# EAGLE design PIC32 USB DAQ Board v1.2 (EAGLE 5.06)
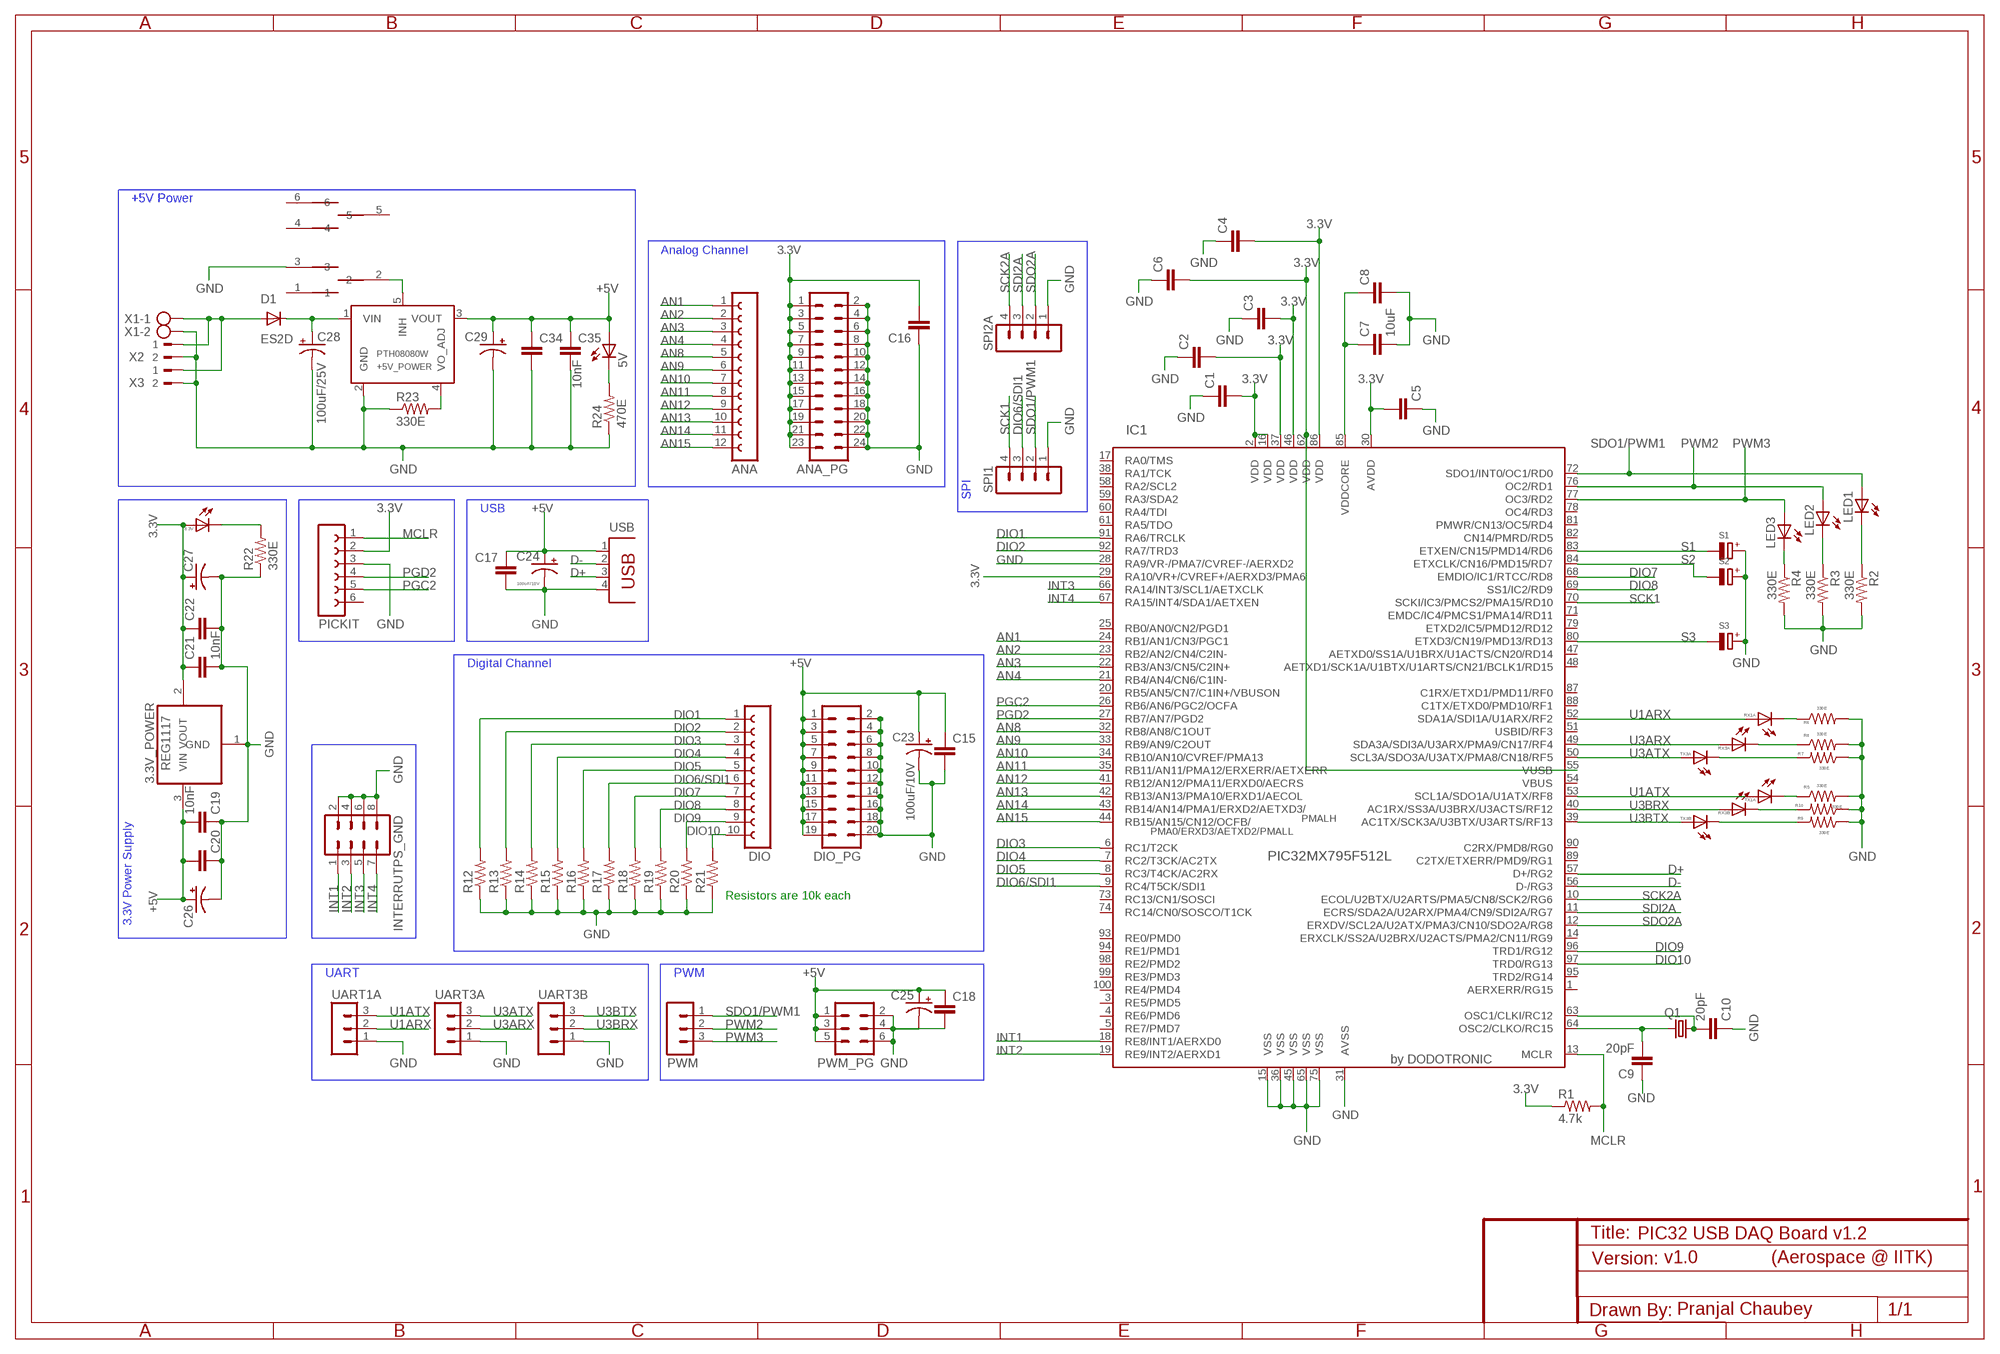
[diagram p0: schematic, sheet 1]

## Parts
3.3V  LEDCHIPLED_0805  [CHIPLED_0805]
3.3V_POWER  REG1117  [SOT223]
5V  LEDCHIPLED_0805  [CHIPLED_0805]
+5V_POWER  PTH08080W  [PTH08080W]
ANA  FE12-1  [FE12]
ANA_PG  MA12-2  [MA12-2]
C1  C-EUC0805  [C0805]
C2  C-EUC0805  [C0805]
C3  C-EUC0805  [C0805]
C4  C-EUC0805  [C0805]
C5  C-EUC0805  [C0805]
C6  C-EUC0805  [C0805]
C7  10uF  C-EUC0805  [C0805]
C8  C-EUC0805  [C0805]
C9  20pF  C-EUC0805  [C0805]
C10  20pF  C-EUC0805  [C0805]
C15  C-EUC0805  [C0805]
C16  C-EUC0805  [C0805]
C17  C-EUC0805  [C0805]
C18  C-EUC0805  [C0805]
C19  10nF  C-EUC0805  [C0805]
C20  C-EUC0805  [C0805]
C21  10nF  C-EUC0805  [C0805]
C22  C-EUC0805  [C0805]
C23  100uF/10V  CPOL-USE2.5-6  [E2,5-6@1]
C24  100uF/10V  CPOL-USE2.5-6  [E2,5-6@1]
C25  CPOL-USE2.5-6  [E2,5-6@1]
C26  CPOL-USE2.5-6  [E2,5-6@1]
C27  CPOL-USE2.5-6  [E2,5-6@1]
C28  100uF/25V  CPOL-USE2.5-6  [E2,5-6@1]
C29  CPOL-USE2.5-6  [E2,5-6@1]
C34  C-EUC0805  [C0805]
C35  10nF  C-EUC0805  [C0805]
D1  ES2D  [SMB]
DIO  FE10-1  [FE10]
DIO_PG  MA10-2  [MA10-2]
IC1  PIC32MX795F512L  [TQFP100_14X14]
INTERRUTPS_GND  MA04-2  [MA04-2]
LED1  LEDCHIPLED_0805  [CHIPLED_0805]
LED2  LEDCHIPLED_0805  [CHIPLED_0805]
LED3  LEDCHIPLED_0805  [CHIPLED_0805]
PICKIT  FE06-1  [FE06]
PWM  MA03-1  [MA03-1]
PWM_PG  MA03-2  [MA03-2]
Q1  CRYSTALSM49  [SM49]
R1  4.7k  R-US_R0805  [R0805]
R2  330E  R-US_R0805  [R0805]
R3  330E  R-US_R0805  [R0805]
R4  330E  R-US_R0805  [R0805]
R5  330E  R-US_R0805  [R0805]
R6  330E  R-US_R0805  [R0805]
R7  330E  R-US_R0805  [R0805]
R8  330E  R-US_R0805  [R0805]
R9  330E  R-US_R0805  [R0805]
R10  330E  R-US_R0805  [R0805]
R12  R-US_R0805  [R0805]
R13  R-US_R0805  [R0805]
R14  R-US_R0805  [R0805]
R15  R-US_R0805  [R0805]
R16  R-US_R0805  [R0805]
R17  R-US_R0805  [R0805]
R18  R-US_R0805  [R0805]
R19  R-US_R0805  [R0805]
R20  R-US_R0805  [R0805]
R21  R-US_R0805  [R0805]
R22  330E  R-US_R0805  [R0805]
R23  330E  R-US_R0805  [R0805]
R24  470E  R-US_R0805  [R0805]
RX1A  LEDCHIPLED_0805  [CHIPLED_0805]
RX3A  LEDCHIPLED_0805  [CHIPLED_0805]
RX3B  LEDCHIPLED_0805  [CHIPLED_0805]
S1  CPOL-EUE5-4  [E5-4]
S2  CPOL-EUE5-4  [E5-4]
S3  CPOL-EUE5-4  [E5-4]
SPI1  MA04-1  [MA04-1]
SPI2A  MA04-1  [MA04-1]
TX1A  LEDCHIPLED_0805  [CHIPLED_0805]
TX3A  LEDCHIPLED_0805  [CHIPLED_0805]
TX3B  LEDCHIPLED_0805  [CHIPLED_0805]
U$1  2WAY  [ON/OFF]
UART1A  MA03-1  [MA03-1]
UART3A  MA03-1  [MA03-1]
UART3B  MA03-1  [MA03-1]
USB  PN87520  [PN87520]
X1  AK500/2  [AK500/2]
X2  90-2  [90-2]
X3  90-2  [90-2]

## Nets
3.3V: 3.3V.A 3.3V_POWER.2(VOUT) ANA_PG.1 ANA_PG.3 ANA_PG.5 ANA_PG.7 ANA_PG.9 ANA_PG.11 ANA_PG.13 ANA_PG.15 ANA_PG.17 ANA_PG.19 ANA_PG.21 ANA_PG.23 C1.2 C2.2 C3.2 C4.2 C5.2 C6.2 C16.2 C21.1 C22.1 C27.+ IC1.2(VDD) IC1.16(VDD) IC1.29(RA10/VR+/CVREF+/AERXD3/PMA6) IC1.30(AVDD) IC1.37(VDD) IC1.46(VDD) IC1.55(VUSB) IC1.62(VDD) IC1.86(VDD) PICKIT.2 R1.1
+5V: 3.3V_POWER.3(VIN) 5V.A +5V_POWER.3(VOUT) C15.1 C17.1 C18.1 C19.2 C20.2 C23.+ C24.+ C25.+ C26.+ C29.+ C34.1 C35.1 DIO_PG.1 DIO_PG.3 DIO_PG.5 DIO_PG.7 DIO_PG.9 DIO_PG.11 DIO_PG.13 DIO_PG.15 DIO_PG.17 DIO_PG.19 PWM_PG.1 PWM_PG.3 PWM_PG.5 USB.1
AN1: ANA.1 IC1.24(RB1/AN1/CN3/PGC1)
AN2: ANA.2 IC1.23(RB2/AN2/CN4/C2IN-)
AN3: ANA.3 IC1.22(RB3/AN3/CN5/C2IN+)
AN4: ANA.4 IC1.21(RB4/AN4/CN6/C1IN-)
AN8: ANA.5 IC1.32(RB8/AN8/C1OUT)
AN9: ANA.6 IC1.33(RB9/AN9/C2OUT)
AN10: ANA.7 IC1.34(RB10/AN10/CVREF/PMA13)
AN11: ANA.8 IC1.35(RB11/AN11/PMA12/ERXERR/AETXERR)
AN12: ANA.9 IC1.41(RB12/AN12/PMA11/ERXD0/AECRS)
AN13: ANA.10 IC1.42(RB13/AN13/PMA10/ERXD1/AECOL)
AN14: ANA.11 IC1.43(RB14/AN14/PMA1/ERXD2/AETXD3/)
AN15: ANA.12 IC1.44(RB15/AN15/CN12/OCFB/)
D+: IC1.57(D+/RG2) USB.3
D-: IC1.56(D-/RG3) USB.2
DIO1: DIO.1 IC1.91(RA6/TRCLK) R12.2
DIO2: DIO.2 IC1.92(RA7/TRD3) R13.2
DIO3: DIO.3 IC1.6(RC1/T2CK) R14.2
DIO4: DIO.4 IC1.7(RC2/T3CK/AC2TX) R15.2
DIO5: DIO.5 IC1.8(RC3/T4CK/AC2RX) R16.2
DIO6/SDI1: DIO.6 IC1.9(RC4/T5CK/SDI1) R17.2 SPI1.3
DIO7: DIO.7 IC1.68(EMDIO/IC1/RTCC/RD8) R18.2
DIO8: DIO.8 IC1.69(SS1/IC2/RD9) R19.2
DIO9: DIO.9 IC1.96(TRD1/RG12) R20.2
DIO10: DIO.10 IC1.97(TRD0/RG13) R21.2
GND: 3.3V_POWER.1(GND) +5V_POWER.2(GND) ANA_PG.2 ANA_PG.4 ANA_PG.6 ANA_PG.8 ANA_PG.10 ANA_PG.12 ANA_PG.14 ANA_PG.16 ANA_PG.18 ANA_PG.20 ANA_PG.22 ANA_PG.24 C1.1 C2.1 C3.1 C4.1 C5.1 C6.1 C7.2 C8.2 C9.1 C10.1 C15.2 C16.1 C17.2 C18.2 C19.1 C20.1 C21.2 C22.2 C23.- C24.- C25.- C26.- C27.- C28.- C29.- C34.2 C35.2 DIO_PG.2 DIO_PG.4 DIO_PG.6 DIO_PG.8 DIO_PG.10 DIO_PG.12 DIO_PG.14 DIO_PG.16 DIO_PG.18 DIO_PG.20 IC1.15(VSS) IC1.28(RA9/VR-/PMA7/CVREF-/AERXD2) IC1.31(AVSS) IC1.36(VSS) IC1.45(VSS) IC1.65(VSS) IC1.75(VSS) INTERRUTPS_GND.2 INTERRUTPS_GND.4 INTERRUTPS_GND.6 INTERRUTPS_GND.8 PICKIT.3 PWM_PG.2 PWM_PG.4 PWM_PG.6 R2.2 R3.2 R4.2 R5.2 R6.2 R7.1 R8.2 R9.1 R10.1 R12.1 R13.1 R14.1 R15.1 R16.1 R17.1 R18.1 R19.1 R20.1 R21.1 R22.1 R23.1 R24.1 S1.+ S2.+ S3.+ SPI1.1 SPI2A.1 U$1.3 UART1A.1 UART3A.1 UART3B.1 USB.4 X1.2 X2.2 X3.2
INT1: IC1.18(RE8/INT1/AERXD0) INTERRUTPS_GND.1
INT2: IC1.19(RE9/INT2/AERXD1) INTERRUTPS_GND.3
INT3: IC1.66(RA14/INT3/SCL1/AETXCLK) INTERRUTPS_GND.5
INT4: IC1.67(RA15/INT4/SDA1/AETXEN) INTERRUTPS_GND.7
MCLR: IC1.13(MCLR) PICKIT.1 R1.2
N$1: C7.1 C8.1 IC1.85(VDDCORE)
N$2: C9.2 IC1.64(OSC2/CLKO/RC15) Q1.2
N$3: C10.2 IC1.63(OSC1/CLKI/RC12) Q1.1
N$4: R6.1 RX1A.C
N$5: R5.1 TX1A.C
N$6: +5V_POWER.4(VO_ADJ) R23.2
N$7: LED3.C R4.1
N$8: LED2.C R3.1
N$9: LED1.C R2.1
N$10: R8.1 RX3A.C
N$11: R9.2 TX3B.C
N$12: R7.2 TX3A.C
N$14: R10.2 RX3B.C
N$15: 3.3V.C R22.2
N$16: +5V_POWER.5(INH) U$1.2
N$18: +5V_POWER.1(VIN) C28.+ D1.C
N$19: 5V.C R24.2
N$20: D1.A X1.1 X2.1 X3.1
PGC2: IC1.26(RB6/AN6/PGC2/OCFA) PICKIT.5
PGD2: IC1.27(RB7/AN7/PGD2) PICKIT.4
PWM2: IC1.76(OC2/RD1) LED2.A PWM.2
PWM3: IC1.77(OC3/RD2) LED3.A PWM.3
S1: IC1.83(ETXEN/CN15/PMD14/RD6) S1.-
S2: IC1.84(ETXCLK/CN16/PMD15/RD7) S2.-
S3: IC1.80(ETXD3/CN19/PMD13/RD13) S3.-
SCK1: IC1.70(SCKI/IC3/PMCS2/PMA15/RD10) SPI1.4
SCK2A: IC1.10(ECOL/U2BTX/U2ARTS/PMA5/CN8/SCK2/RG6) SPI2A.4
SDI2A: IC1.11(ECRS/SDA2A/U2ARX/PMA4/CN9/SDI2A/RG7) SPI2A.3
SDO1/PWM1: IC1.72(SDO1/INT0/OC1/RD0) LED1.A PWM.1 SPI1.2
SDO2A: IC1.12(ERXDV/SCL2A/U2ATX/PMA3/CN10/SDO2A/RG8) SPI2A.2
U1ARX: IC1.52(SDA1A/SDI1A/U1ARX/RF2) RX1A.A UART1A.2
U1ATX: IC1.53(SCL1A/SDO1A/U1ATX/RF8) TX1A.A UART1A.3
U3ARX: IC1.49(SDA3A/SDI3A/U3ARX/PMA9/CN17/RF4) RX3A.A UART3A.2
U3ATX: IC1.50(SCL3A/SDO3A/U3ATX/PMA8/CN18/RF5) TX3A.A UART3A.3
U3BRX: IC1.40(AC1RX/SS3A/U3BRX/U3ACTS/RF12) RX3B.A UART3B.2
U3BTX: IC1.39(AC1TX/SCK3A/U3BTX/U3ARTS/RF13) TX3B.A UART3B.3
Unconnected: IC1.1(AERXERR/RG15) IC1.3(RE5/PMD5) IC1.4(RE6/PMD6) IC1.5(RE7/PMD7) IC1.14(ERXCLK/SS2A/U2BRX/U2ACTS/PMA2/CN11/RG9) IC1.17(RA0/TMS) IC1.20(RB5/AN5/CN7/C1IN+/VBUSON) IC1.25(RB0/AN0/CN2/PGD1) IC1.38(RA1/TCK) IC1.47(AETXD0/SS1A/U1BRX/U1ACTS/CN20/RD14) IC1.48(AETXD1/SCK1A/U1BTX/U1ARTS/CN21/BCLK1/RD15) IC1.51(USBID/RF3) IC1.54(VBUS) IC1.58(RA2/SCL2) IC1.59(RA3/SDA2) IC1.60(RA4/TDI) IC1.61(RA5/TDO) IC1.71(EMDC/IC4/PMCS1/PMA14/RD11) IC1.73(RC13/CN1/SOSCI) IC1.74(RC14/CN0/SOSCO/T1CK) IC1.78(OC4/RD3) IC1.79(ETXD2/IC5/PMD12/RD12) IC1.81(PMWR/CN13/OC5/RD4) IC1.82(CN14/PMRD/RD5) IC1.87(C1RX/ETXD1/PMD11/RF0) IC1.88(C1TX/ETXD0/PMD10/RF1) IC1.89(C2TX/ETXERR/PMD9/RG1) IC1.90(C2RX/PMD8/RG0) IC1.93(RE0/PMD0) IC1.94(RE1/PMD1) IC1.95(TRD2/RG14) IC1.98(RE2/PMD2) IC1.99(RE3/PMD3) IC1.100(RE4/PMD4) PICKIT.6 U$1.1 U$1.4 U$1.5 U$1.6

## Notes on the sheet
- +5V Power
- Analog Channel
- SPI
- USB
- Digital Channel
- Resistors are 10k each
- 3.3V Power Supply
- UART | PWM
- v1.0 | (Aerospace @ IITK)
- Pranjal Chaubey

## Library data of the parts
3.3V 5V LED1-LED3 RX1A RX3A RX3B TX1A TX3A TX3B = led:LED: LED OSRAM: - CHIPLED LG R971, LG N971, LY N971, LG Q971, LY Q971, LO R971, LY R971 LH N974, LH R974 LS Q976, LO Q976, LY Q976 LO Q996 - Hyper CHIPLED LW Q18S LB Q993, LB Q99A, LB R99A - SideLED LS A670, LO A670, LY A670, LG A670, LP A670 LB A673, LV A673, LT A673, LW A673 LH A674 LY A675 LS A676, LA A676, LO A676, LY A676, LW A676 LS A679, LY A679, LG A679 - Hyper Micro SIDELED® LS Y876, LA Y876, LO Y876, LY Y876 LT Y87S - SmartLED LW L88C, LW L88S LB L89C, LB L89S, LG L890 LS L89K, LO L89K, LY L89K LS L896, LA L896, LO L896, LY L896 - TOPLED LS T670, LO T670, LY T670, LG T670, LP T670 LSG T670, LSP T670, LSY T670, LOP T670, LYG T670 LG T671, LOG T671, LSG T671 LB T673, LV T673, LT T673, LW T673 LH T674 LS T676, LA T676, LO T676, LY T676, LB T676, LH T676, LSB T676, LW T676 LB T67C, LV T67C, LT T67C, LS T67K, LO T67K, LY T67K, LW E67C LS E67B, LA E67B, LO E67B, LY E67B, LB E67C, LV E67C, LT E67C LW T67C LS T679, LY T679, LG T679 LS T770, LO T770, LY T770, LG T770, LP T770 LB T773, LV T773, LT T773, LW T773 LH T774 LS E675, LA E675, LY E675, LS T675 LS T776, LA T776, LO T776, LY T776, LB T776 LHGB T686 LT T68C, LB T68C - Hyper Mini TOPLED® LB M676 - Mini TOPLED Santana® LG M470 LS M47K, LO M47K, LY M47K Source: http://www.osram.convergy.de LUXEON: - LUMILED® LXK2-PW12-R00, LXK2-PW12-S00, LXK2-PW14-U00, LXK2-PW14-V00 LXK2-PM12-R00, LXK2-PM12-S00, LXK2-PM14-U00 LXK2-PE12-Q00, LXK2-PE12-R00, LXK2-PE12-S00, LXK2-PE14-T00, LXK2-PE14-U00 LXK2-PB12-K00, LXK2-PB12-L00, LXK2-PB12-M00, LXK2-PB14-N00, LXK2-PB14-P00, LXK2-PB14-Q00 LXK2-PR12-L00, LXK2-PR12-M00, LXK2-PR14-Q00, LXK2-PR14-R00 LXK2-PD12-Q00, LXK2-PD12-R00, LXK2-PD12-S00 LXK2-PH12-R00, LXK2-PH12-S00 LXK2-PL12-P00, LXK2-PL12-Q00, LXK2-PL12-R00 Source: www.luxeon.com KINGBRIGHT: KA-3528ASYC Source: www.kingbright.com
3.3V_POWER = burr-brown:REG1117: 800mA and 1A Low Dropout (LDO) Positive Regulator 1.8V, 2.5V, 2.85V, 3.3V, 5V, and Adj
+5V_POWER = Pranjal:PTH08080W: 2.25A, Wide Input Adjustable Switching Regulator
ANA = con-lsta:FE12-1: FEMALE HEADER
ANA_PG = con-lstb:MA12-2: PIN HEADER
C1-C10 C15-C22 C34 C35 = rcl:C-EU: CAPACITOR, European symbol
C23-C29 = rcl:CPOL-US: POLARIZED CAPACITOR, American symbol
D1 = diode:ES2D: DIODE super fast rectifier, 2 A
DIO = con-lsta:FE10-1: FEMALE HEADER
DIO_PG = con-lstb:MA10-2: PIN HEADER
IC1 = DodoMicroR3:PIC32MX795F512: USB, CAN and Ethernet 32-bit Flash Microcontroller
INTERRUTPS_GND = con-lstb:MA04-2: PIN HEADER
PICKIT = con-lsta:FE06-1: FEMALE HEADER
PWM UART1A UART3A UART3B = con-lstb:MA03-1: PIN HEADER
PWM_PG = con-lstb:MA03-2: PIN HEADER
Q1 = crystal:CRYSTAL: CRYSTAL
R1-R10 R12-R24 = rcl:R-US_: RESISTOR, American symbol
S1-S3 = rcl:CPOL-EU: POLARIZED CAPACITOR, European symbol
SPI1 SPI2A = con-lstb:MA04-1: PIN HEADER
U$1 = tri:2WAY
USB = con-berg:PN87520: BERG USB connector
X1 = con-ptr500:AK500/2: CONNECTOR
X2 X3 = con-weidmueller-sl35:90-2: WEIDMUELLER CLAMP CONNECTOR

## Board
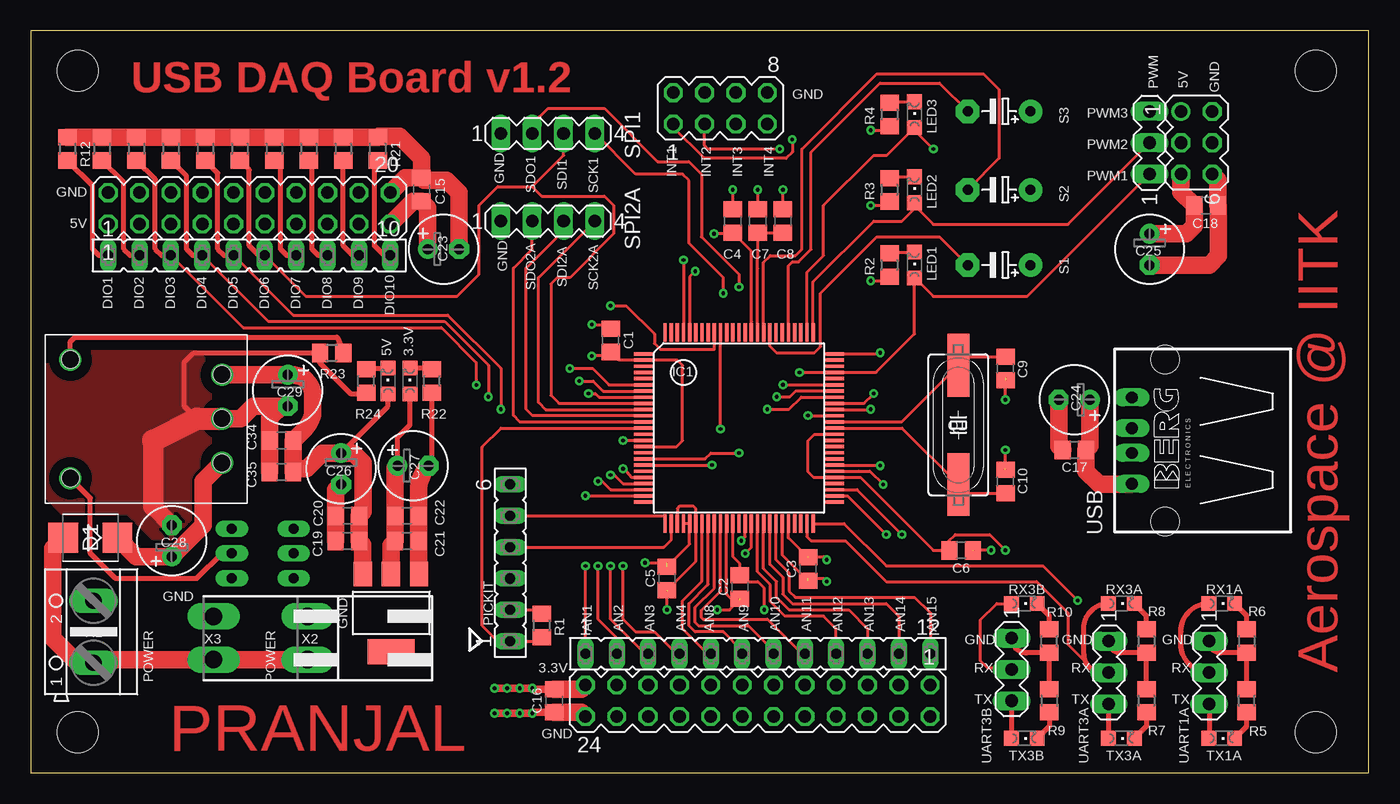
[diagram p1: board, top side]
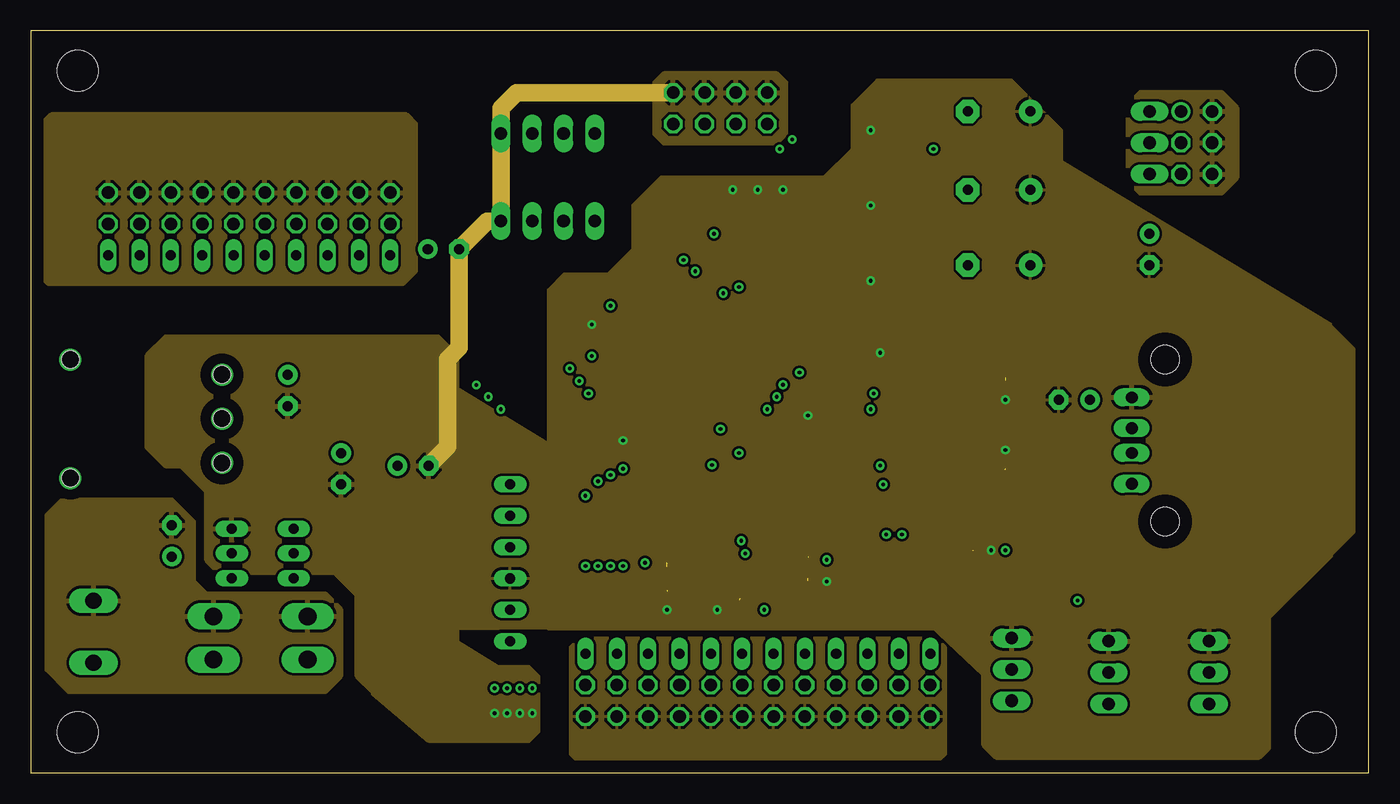
[diagram p2: board, inner layer GND]
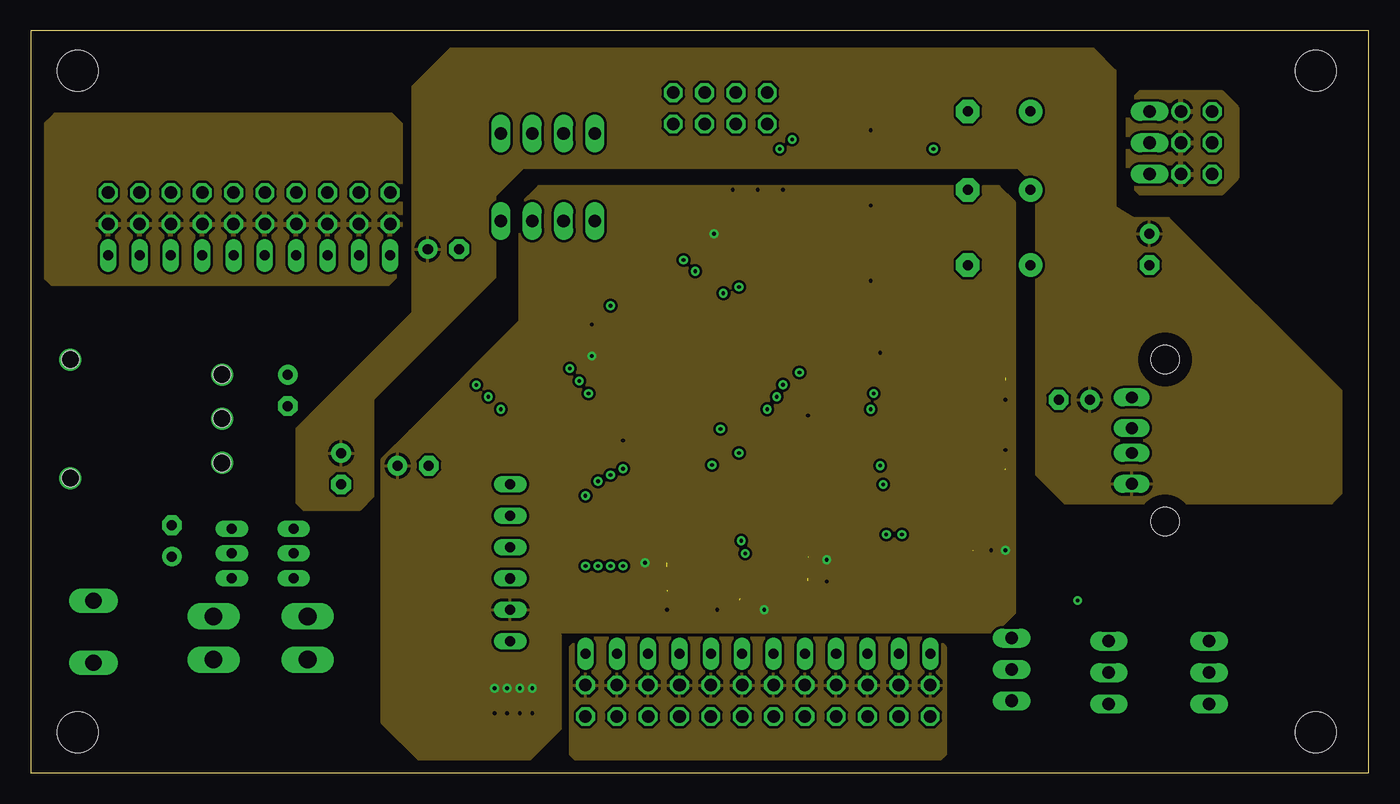
[diagram p3: board, inner layer POWER]
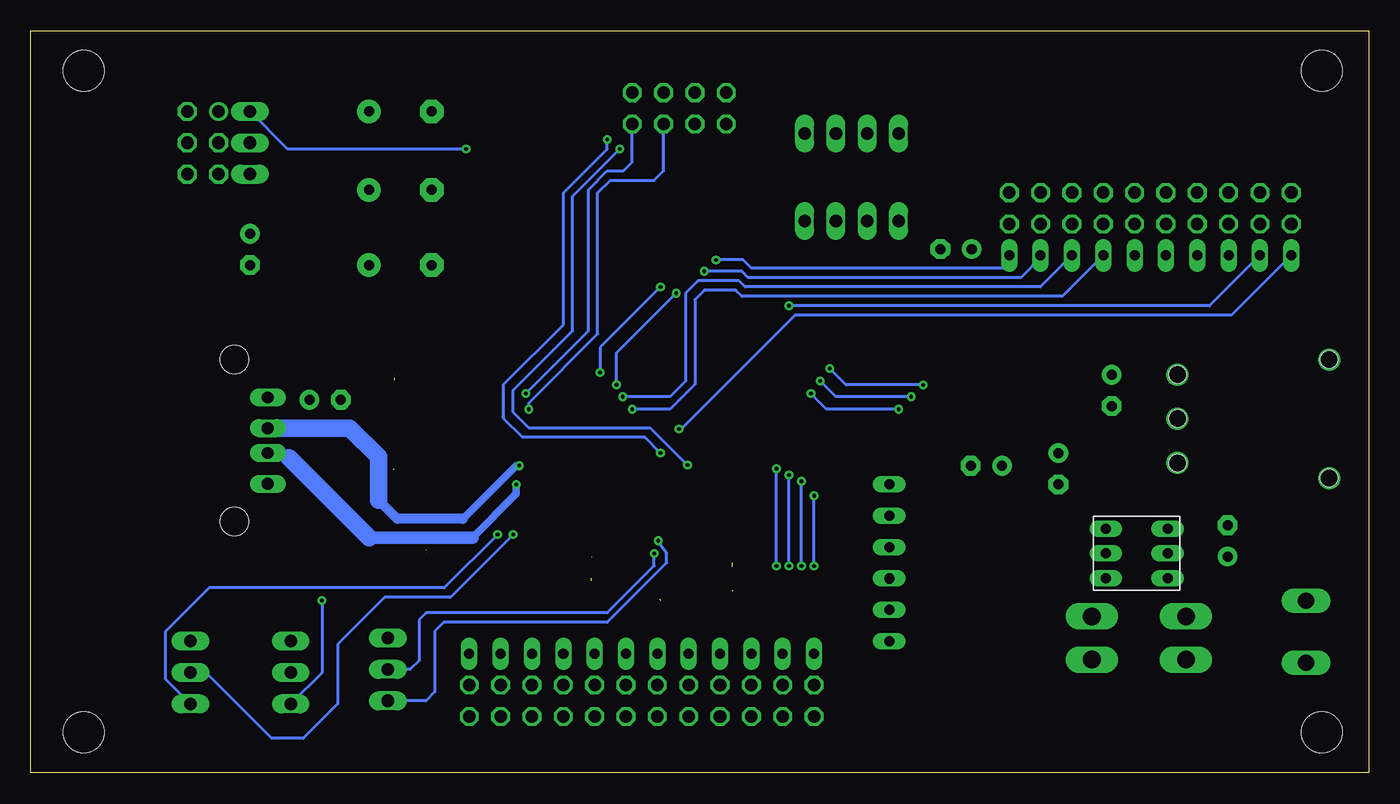
[diagram p4: board, bottom side, seen from below]

Size 108.44 x 60.12 mm. Coordinates in mm from the lower left corner, seen from the top.
Outline: 0,0 108.44,0 108.44,60.12 0,60.12 0,0
Copper layers [3:((1*2)+(3*16))]: Top 0.035mm / dielectric 0.1mm / GND 0.035mm / dielectric 1.26mm / POWER 0.035mm / dielectric 0.1mm / Bottom 0.035mm
Design rules "default *": minimum track width 10mil, minimum drill 0.3mm, track to track 8mil, track to pad 8mil, pad to pad 8mil, via to via 8mil, smd to smd 8mil, copper to edge 40mil, drill to drill 8mil, minimum pad ring 10mil, minimum via ring 8mil, stop-mask expansion 4mil, vias tented up to drill 0mil, thermal gap 10mil

### Footprints (pad centres in the part's own frame; a part is rotated, then mirrored left to right if it is on the bottom)
CHIPLED_0805 = smd 1.2 x 1.2: A 0,-1.05; C 0,1.05
SOT223 = smd 1.499 x 2.007: 1 -2.261,-3.15; 2 0.025,-3.15; 3 2.311,-3.15 | smd 3.81 x 2.007: 4 0,3.15
PTH08080W = drill 1.1 pad 1.778 round: 1 2.032,10.439; 2 2.032,6.858; 3 2.032,3.302; 4 14.326,2.083; 5 14.326,11.684 | hole 1.4: 2.032,10.439; 2.032,6.858; 2.032,3.302; 14.326,2.083; 14.326,11.684
FE12 = drill 0.813 long: 1 -13.97,0; 2 -11.43,0; 3 -8.89,0; 4 -6.35,0; 5 -3.81,0; 6 -1.27,0; 7 1.27,0; 8 3.81,0; 9 6.35,0; 10 8.89,0; 11 11.43,0; 12 13.97,0
MA12-2 = drill 1.016 octagon: 1 -13.97,-1.27; 2 -13.97,1.27; 3 -11.43,-1.27; 4 -11.43,1.27; 5 -8.89,-1.27; 6 -8.89,1.27; 7 -6.35,-1.27; 8 -6.35,1.27; 9 -3.81,-1.27; 10 -3.81,1.27; 11 -1.27,-1.27; 12 -1.27,1.27; 13 1.27,-1.27; 14 1.27,1.27; 15 3.81,-1.27; 16 3.81,1.27; 17 6.35,-1.27; 18 6.35,1.27; 19 8.89,-1.27; 20 8.89,1.27; 21 11.43,-1.27; 22 11.43,1.27; 23 13.97,-1.27; 24 13.97,1.27
C0805 = smd 1.3 x 1.5: 1 -0.95,0; 2 0.95,0
E2,5-6@1 = drill 0.813 pad 1.6 round: + -1.27,0 | drill 0.813 pad 1.6 octagon: - 1.27,0
SMB = smd 2.4 x 2.4: A 2.2,0; C -2.2,0
FE10 = drill 0.813 long: 1 -11.43,0; 2 -8.89,0; 3 -6.35,0; 4 -3.81,0; 5 -1.27,0; 6 1.27,0; 7 3.81,0; 8 6.35,0; 9 8.89,0; 10 11.43,0
MA10-2 = drill 1.016 octagon: 1 -11.43,-1.27; 2 -11.43,1.27; 3 -8.89,-1.27; 4 -8.89,1.27; 5 -6.35,-1.27; 6 -6.35,1.27; 7 -3.81,-1.27; 8 -3.81,1.27; 9 -1.27,-1.27; 10 -1.27,1.27; 11 1.27,-1.27; 12 1.27,1.27; 13 3.81,-1.27; 14 3.81,1.27; 15 6.35,-1.27; 16 6.35,1.27; 17 8.89,-1.27; 18 8.89,1.27; 19 11.43,-1.27; 20 11.43,1.27
TQFP100_14X14 = smd 0.27 x 1.5: 1 -6,-7.75; 2 -5.5,-7.75; 3 -5,-7.75; 4 -4.5,-7.75; 5 -4,-7.75; 6 -3.5,-7.75; 7 -3,-7.75; 8 -2.5,-7.75; 9 -2,-7.75; 10 -1.5,-7.75; 11 -1,-7.75; 12 -0.5,-7.75; 13 0,-7.75; 14 0.5,-7.75; 15 1,-7.75; 16 1.5,-7.75; 17 2,-7.75; 18 2.5,-7.75; 19 3,-7.75; 20 3.5,-7.75; 21 4,-7.75; 22 4.5,-7.75; 23 5,-7.75; 24 5.5,-7.75; 25 6,-7.75; 51 6,7.75; 52 5.5,7.75; 53 5,7.75; 54 4.5,7.75; 55 4,7.75; 56 3.5,7.75; 57 3,7.75; 58 2.5,7.75; 59 2,7.75; 60 1.5,7.75; 61 1,7.75; 62 0.5,7.75; 63 0,7.75; 64 -0.5,7.75; 65 -1,7.75; 66 -1.5,7.75; 67 -2,7.75; 68 -2.5,7.75; 69 -3,7.75; 70 -3.5,7.75; 71 -4,7.75; 72 -4.5,7.75; 73 -5,7.75; 74 -5.5,7.75; 75 -6,7.75 | smd 1.5 x 0.27: 26 7.75,-6; 27 7.75,-5.5; 28 7.75,-5; 29 7.75,-4.5; 30 7.75,-4; 31 7.75,-3.5; 32 7.75,-3; 33 7.75,-2.5; 34 7.75,-2; 35 7.75,-1.5; 36 7.75,-1; 37 7.75,-0.5; 38 7.75,0; 39 7.75,0.5; 40 7.75,1; 41 7.75,1.5; 42 7.75,2; 43 7.75,2.5; 44 7.75,3; 45 7.75,3.5; 46 7.75,4; 47 7.75,4.5; 48 7.75,5; 49 7.75,5.5; 50 7.75,6; 76 -7.75,6; 77 -7.75,5.5; 78 -7.75,5; 79 -7.75,4.5; 80 -7.75,4; 81 -7.75,3.5; 82 -7.75,3; 83 -7.75,2.5; 84 -7.75,2; 85 -7.75,1.5; 86 -7.75,1; 87 -7.75,0.5; 88 -7.75,0; 89 -7.75,-0.5; 90 -7.75,-1; 91 -7.75,-1.5; 92 -7.75,-2; 93 -7.75,-2.5; 94 -7.75,-3; 95 -7.75,-3.5; 96 -7.75,-4; 97 -7.75,-4.5; 98 -7.75,-5; 99 -7.75,-5.5; 100 -7.75,-6
MA04-2 = drill 1.016 octagon: 1 -3.81,-1.27; 2 -3.81,1.27; 3 -1.27,-1.27; 4 -1.27,1.27; 5 1.27,-1.27; 6 1.27,1.27; 7 3.81,-1.27; 8 3.81,1.27
STAND-OFF = hole 3.302: 0,0
FE06 = drill 0.813 long: 1 -6.35,0; 2 -3.81,0; 3 -1.27,0; 4 1.27,0; 5 3.81,0; 6 6.35,0
MA03-1 = drill 1.016 long: 1 -2.54,0; 2 0,0; 3 2.54,0
MA03-2 = drill 1.016 round: 1 -2.54,-1.27 | drill 1.016 octagon: 2 -2.54,1.27; 3 0,-1.27; 4 0,1.27; 5 2.54,-1.27; 6 2.54,1.27
SM49 = smd 5.08 x 1.778: 1 -4.826,0; 2 4.826,0
R0805 = smd 1.3 x 1.5: 1 -0.95,0; 2 0.95,0
E5-4 = drill 0.813 pad 1.905 round: + -2.54,0 | drill 0.813 pad 1.905 octagon: - 2.54,0
MA04-1 = drill 1.016 long: 1 -3.81,0; 2 -1.27,0; 3 1.27,0; 4 3.81,0
ON/OFF = drill 0.813 long: 1 -2.5,2; 2 -2.5,0; 3 -2.5,-2; 4 2.5,-2; 5 2.5,0; 6 2.5,2
PN87520 = drill 0.95 long: 1 -3.5,2.71; 2 -1,2.71; 3 1,2.71; 4 3.5,2.71 | hole 2.3: -6.57,0; 6.57,0
AK500/2 = drill 1.321 long: 1 -2.515,0; 2 2.515,0
90-2 = drill 1.422 long: 1 -1.75,5.25; 2 1.75,5.25

### Placement (x,y rotation side)
3.3V  30.73,31.75 0 top
3.3V_POWER  29.21,12.95 180 top
5V  28.96,31.75 0 top
+5V_POWER  17.53,35.56 180 top
ANA  58.93,9.65 0 top
ANA_PG  58.93,5.84 180 top
C1  46.99,35.05 270 top
C2  57.47,15.07 90 top
C3  62.99,16.51 90 top
C4  56.9,44.7 270 top
C5  51.56,15.75 90 top
C6  75.39,18.03 180 top
C7  58.93,44.7 90 top
C8  60.96,44.7 90 top
C9  78.99,32.77 90 top
C10  78.99,23.62 270 top
C15  31.67,47.27 90 top
C16  42.42,5.84 90 top
C17  84.58,26.16 180 top
C18  95.25,45.97 0 top
C19  25.65,18.8 0 top
C20  25.65,20.83 0 top
C21  30.48,18.8 0 top
C22  30.48,20.83 0 top
C23  33.45,42.44 0 top
C24  84.58,30.23 180 top
C25  90.68,42.42 270 top
C26  25.15,24.64 270 top
C27  30.99,24.89 0 top
C28  11.43,18.8 90 top
C29  20.83,30.99 270 top
C34  20.32,26.92 180 top
C35  20.32,24.38 180 top
D1  4.83,19.05 180 top
DIO  17.7,41.93 0 top
DIO_PG  17.7,45.74 0 top
IC1  57.4,27.94 270 top
INTERRUTPS_GND  55.88,53.85 0 top
JP1  STAND-OFF  [STAND-OFF]  3.81,56.9 90 top
JP2  STAND-OFF  [STAND-OFF]  3.81,3.3 90 top
JP3  STAND-OFF  [STAND-OFF]  104.14,56.9 90 top
JP4  STAND-OFF  [STAND-OFF]  104.14,3.3 90 top
LED1  71.63,41.15 0 top
LED2  71.63,47.24 0 top
LED3  71.63,53.34 0 top
PICKIT  38.86,17.02 90 top
PWM  90.68,51.05 90 top
PWM_PG  94.49,51.05 270 top
Q1  75.18,28.19 90 top
R1  41.4,11.94 270 top
R2  69.6,41.15 270 top
R3  69.6,47.24 270 top
R4  69.6,53.34 270 top
R5  98.55,5.84 90 top
R6  98.55,10.67 270 top
R7  90.42,5.84 270 top
R8  90.42,10.67 270 top
R9  82.55,5.84 270 top
R10  82.55,10.67 90 top
R12  2.97,50.57 270 top
R13  5.76,50.57 270 top
R14  8.56,50.57 270 top
R15  11.35,50.57 270 top
R16  14.14,50.57 270 top
R17  16.94,50.57 270 top
R18  19.73,50.57 270 top
R19  22.53,50.57 270 top
R20  25.32,50.57 270 top
R21  28.11,50.57 270 top
R22  32.51,31.75 90 top
R23  24.38,34.04 0 top
R24  27.18,31.75 90 top
RX1A  96.52,13.72 270 top
RX3A  88.39,13.72 270 top
RX3B  80.52,13.72 270 top
S1  78.49,41.15 180 top
S2  78.49,47.24 180 top
S3  78.49,53.59 180 top
SPI1  41.91,51.82 0 top
SPI2A  41.91,44.7 0 top
TX1A  96.52,2.79 270 top
TX3A  88.39,2.79 270 top
TX3B  80.52,2.79 270 top
U$1  18.8,17.78 180 bottom
UART1A  95.5,8.13 270 top
UART3A  87.38,8.13 270 top
UART3B  79.5,8.38 270 top
USB  91.95,26.92 90 top
X1  5.08,11.43 90 top
X2  27.69,10.92 90 top
X3  20.07,10.92 90 top

### Tracks (layer width: path | path; a pad name or v marks a point on that pad's centre or on a via)
3.3V  (via drill 0.3 layers 1-3)  (2 unrouted)
  Top 0.254: IC1.16 52.35,26.44 52.83,26.92 52.83,33.02 52.4,33.45 49.82,33.45 IC1.2 47.65,33.44 C1.2 46.67,33.78 v45.47,33.78 | C3.2 61.4,19.05 IC1.46 | IC1.29 IC1.30 53.4,18.54 C5.2 | C6.2 74.38,18.1 | IC1.62 63.5,27.43 62.99,26.92 62.99,24.38 63.44,23.94 IC1.55 67.25,23.94 73.15,18.03 C6.2 | IC1.86 58.42,35.71 58.42,36.58 58.41,42.26 C4.2 56.83,43.69 v55.37,43.69 | R1.1 41.4,13.21 PICKIT.2 | v49.78,17.02 51.56,17.02 | IC1.37 56.91,17.53 57.47,16.96 C2.2 57.49,16 57.66,16 58.17,15.49 58.93,15.49 59.44,14.99 v59.44,13.21 | C6.2 | v78.99,18.03 77.72,19.3 74.93,19.3 74.42,18.8 74.42,18.06 C6.2 | 62.99,17.53 64.26,17.53 v64.52,17.27
  Top 0.406: 3.3V.A 30.73,28.19 29.72,27.18 C27.+
  Top 0.61: C16.2 40.71,6.79 v40.64,6.86 v39.62,6.86 v38.61,6.86 v37.59,6.86
  Top 1.422: 3.3V_POWER.2 29.18,18.45 C21.1 C22.1 29.53,24.7 C27.+ | C16.2 44.64,6.79 ANA_PG.23
  pour POWER: 74.17,10.16 73.41,10.92 44.45,10.92 43.69,10.16 43.69,1.52 44.2,1.02 73.66,1.02 74.17,1.52
  pour POWER: 42.93,11.18 34.8,19.3 34.8,25.4 32.51,27.69 30.73,27.69 28.45,25.4 28.45,4.06 31.5,1.02 40.39,1.02 42.93,3.56
  pour POWER: 79.76,45.72 79.76,46.23 78.49,47.5 41.15,47.5 39.62,45.97 39.62,36.58 30.73,27.69 30.73,23.37 42.67,11.43 78.23,11.43 79.76,12.95
+5V
  Top 0.406: 5V.A 28.96,29.72 C26.+
  Top 1.422: +5V_POWER.3 C29.+ 21.16,32.26 arc-90 22.86,30.55 22.86,29.46 arc-45 22.19,27.84 C34.1 C35.1 21.52,24.64 22.35,24.64 23.62,25.91 C26.+ 26.16,25.91 26.92,25.15 26.92,21.15 C20.2 C19.2 26.9,18.5 3.3V_POWER.3 | DIO_PG.19 30.98,46.31 C15.1 32.18,45.81 C23.+ | C25.+ 93.67,43.69 94.3,44.32 C18.1 93.22,47.06 PWM_PG.5 | C24.+ 85.85,26.48 C17.1 85.53,24.45 86.61,23.37 89.18,23.37 USB.1
  pour POWER: 96.52,46.99 97.79,48.26 97.79,53.85 96.52,55.12 89.92,55.12 88.9,54.1 88.9,48.01 89.92,46.99
  pour POWER: 2,53.33 29.18,53.33 29.94,52.57 29.94,40.63 28.92,39.61 1.74,39.61 0.98,40.37 0.98,52.31
  pour POWER: 91.69,21.84 83.82,21.84 81.53,24.13 81.53,47.5 80.01,49.02 39.88,49.02 37.59,46.74 37.59,40.13 33.53,36.07 27.69,30.23 27.69,22.35 26.67,21.34 22.1,21.34 21.59,21.84 21.59,27.94 30.99,37.34 30.99,55.63 34.04,58.67 86.11,58.67 87.88,56.9 87.88,45.83 89.33,44.96 92.2,44.96 106.17,30.99 106.17,22.61 105.41,21.84
AN1  (via drill 0.3)
  Top 0.254: ANA.1 v44.96,16.76 | v44.95,22.45 49.56,22.45 IC1.24
  Bottom 0.254: v44.96,16.76 v44.95,22.45
AN2  (via drill 0.3)
  Top 0.254: ANA.2 47.5,10.92 45.97,12.45 v45.97,16.76 | v45.97,23.62 46.31,23.62 46.99,22.94 IC1.23
  Bottom 0.254: v45.97,16.76 v45.97,23.62
AN3  (via drill 0.3)
  Top 0.254: ANA.3 49.78,9.65 46.99,12.45 v46.99,16.76 | v46.99,24.13 47.29,24.13 47.99,23.44 IC1.22
  Bottom 0.254: v46.99,16.76 v46.99,24.13
AN4  (via drill 0.3)
  Top 0.254: ANA.4 52.32,9.65 50.55,11.43 49.02,11.43 48.01,12.45 v48.01,16.76 | v48.01,24.64 48.11,24.64 48.69,23.94 IC1.21
  Bottom 0.254: v48.01,16.76 v48.01,24.64
AN8
  Top 0.254: ANA.5 54.86,9.65 52.83,11.68 52.83,13.95 54.4,15.52 IC1.32
AN9
  Top 0.254: ANA.6 57.66,9.91 56.13,11.43 53.85,11.43 53.34,11.94 53.34,13.72 54.86,15.24 54.9,15.29 IC1.33
AN10
  Top 0.254: ANA.7 60.2,9.91 58.17,11.94 54.1,11.94 53.85,12.19 53.85,13.41 55.4,14.97 IC1.34
AN11
  Top 0.254: ANA.8 62.48,9.65 59.69,12.45 54.48,12.45 54.37,12.56 54.38,13.2 54.39,13.2 55.92,14.73 IC1.35
AN12
  Top 0.254: ANA.9 65.28,11.68 64.26,12.7 61.11,12.7 59.94,13.87 59.94,15.24 58.9,16.28 58.9,16.29 IC1.41
AN13
  Top 0.254: ANA.10 67.82,11.68 66.29,13.21 61.47,13.21 60.45,14.23 60.45,15.49 59.4,16.54 IC1.42
AN14
  Top 0.254: ANA.11 70.36,12.7 69.34,13.72 61.72,13.72 60.96,14.48 60.96,15.84 59.9,16.89 IC1.43
AN15
  Top 0.254: ANA.12 72.9,12.95 71.63,14.22 61.98,14.22 61.47,14.73 61.47,16.2 60.4,17.26 IC1.44
D+  (via drill 0.3)
  Top 0.254: IC1.57 68.79,24.94 v68.83,24.89
  Bottom 0.254: v68.83,24.89 69.09,24.89
  Bottom 0.61: 69.09,24.89 73.41,20.57
  Bottom 0.813: 73.41,20.57 78.74,20.57 80.26,22.1
  Bottom 1.422: 80.26,22.1 80.26,25.59 82.59,27.92 USB.3
D-  (via drill 0.3)
  Top 0.254: IC1.56 67.11,24.44 67.12,24.45 68.01,24.45 v69.09,23.37
  Bottom 0.61: v69.09,23.37 69.09,22.61 72.64,19.05 | 87.52,25.54 arc-45 88.44,25.92
  Bottom 1.016: 72.64,19.05 81.03,19.05
  Bottom 1.422: 81.03,19.05 87.52,25.54 | 88.44,25.92 USB.2
DIO1  (via drill 0.3)
  Top 0.254: v55.9,27.87 IC1.91
  Top 0.406: DIO.1 5.51,41.93 5,42.44 5,47.59 R12.2
  Bottom 0.254: v55.9,27.87 55.7,27.87 46.48,37.08 11.12,37.08 DIO.1
DIO2  (via drill 0.3)
  Top 0.254: v46.99,37.85 48.26,37.85 50.55,35.56 50.55,34.8 51.04,34.31 55.4,34.31 IC1.92
  Top 0.406: DIO.2 8.05,41.93 7.54,42.44 7.54,47.84 R13.2
  Bottom 0.254: DIO.2 12.9,37.85 v46.99,37.85
DIO3  (via drill 0.3)
  Top 0.254: DIO.3 17.21,36.07 33.27,36.07 36.11,33.24 v36.11,31.43 | v43.69,32.77 45.53,32.77 46.85,31.45 IC1.6
  Top 0.406: DIO.3 10.59,41.93 10.08,42.44 10.08,48.09 R14.2
  Bottom 0.254: v36.11,31.43 42.35,31.43 v43.69,32.77
DIO4  (via drill 0.3)
  Top 0.254: DIO.4 19.25,36.58 33.53,36.58 37.08,33.02 v37.08,30.48 | v44.45,31.75 45.58,31.75 46.39,30.94 IC1.7 | IC1.7
  Top 0.406: DIO.4 13.13,41.93 12.62,42.44 12.62,48.35 R15.2
  Bottom 0.254: v37.08,30.48 43.18,30.48 v44.45,31.75
DIO5  (via drill 0.3)
  Top 0.254: DIO.5 21.28,37.08 33.78,37.08 38.1,32.77 v38.1,29.46 | v45.21,30.73 45.77,30.73 46.07,30.43 IC1.8
  Top 0.406: DIO.5 15.67,41.93 15.16,42.44 15.16,48.6 R16.2
  Bottom 0.254: v38.1,29.46 43.94,29.46 v45.21,30.73
DIO6/SDI1
  Top 0.254: 40.64,47.5 41.4,46.74 46.48,46.74 47.24,45.97 47.24,43.69 43.69,40.13 42.67,40.13 42.16,39.62 42.16,30.58 42.81,29.94 IC1.9 | DIO.6 22.29,38.61 34.54,38.61 36.32,40.39 36.32,45.97 37.85,47.5 40.64,47.5 | SPI1.3 43.18,50.04 40.64,47.5
  Top 0.406: DIO.6 18.46,41.93 17.7,42.69 17.7,48.85 R17.2
DIO7  (via drill 0.3)
  Top 0.254: v59.69,29.46 61.47,29.46 62.44,30.44 IC1.68
  Top 0.406: DIO.7 20.75,41.93 20.24,42.44 20.24,49.11 R18.2
  Bottom 0.254: v59.69,29.46 56.64,29.46 54.61,31.5 54.61,38.35 53.85,39.12 51.31,39.12 50.8,38.61 24.83,38.61 DIO.7
DIO8  (via drill 0.3)
  Top 0.254: v60.45,30.48 61.54,30.48 62.01,30.95 IC1.69
  Top 0.406: DIO.8 23.29,41.93 22.78,42.44 22.78,49.36 R19.2
  Bottom 0.254: v60.45,30.48 56.64,30.48 55.37,31.75 55.37,38.86 54.36,39.88 51.05,39.88 50.55,39.37 26.61,39.37 DIO.8
DIO9  (via drill 0.3)
  Top 0.254: v53.85,40.64 53.4,40.2 IC1.96
  Top 0.406: DIO.9 26.08,41.93 25.32,42.69 R20.2
  Bottom 0.254: DIO.9 26.59,41.73 28.19,40.13 50.29,40.13 50.8,40.64 v53.85,40.64
DIO10  (via drill 0.3)
  Top 0.254: v52.91,41.56 IC1.97
  Top 0.406: DIO.10 28.62,41.93 27.86,42.69 27.86,49.36 R21.2
  Bottom 0.254: DIO.10 29.13,40.97 29.21,40.89 50.04,40.89 50.7,41.56 v52.91,41.56
GND  (via drill 0.3 layers 1-2)  (6 unrouted)
  Top 0.254: C3.1 60.9,17.65 IC1.45 | C2.1 56.76,14.11 56.39,14.48 56.39,20.17 IC1.36 | 57.4,13.97 56.64,13.21 v55.63,13.21 | v77.85,18.03 76.41,18.03 | v78.99,30.23 78.99,32 | 78.99,24.64 v78.99,26.16 | C4.1 v56.9,47.24 | C7.2 v58.93,47.24 | C8.2 v60.96,47.24 | R4.2 arc-90 69.28,52.07 v68.07,52.07 | R3.2 arc-90 69.28,45.97 v68.07,45.97 | R2.2 arc-90 69.28,39.88 v68.07,39.88 | C1.1 46.67,36.32 v45.47,36.32 | C5.1 53.9,17.14 IC1.31 53.9,21.41 53.72,21.59 52.58,21.59 52.4,21.42 IC1.28 | v51.56,13.21 51.56,14.73 | IC1.15 48.02,26.94 v48.01,26.92 | IC1.65 63.01,28.94 v62.99,28.96 | IC1.75 68.74,33.94 v68.83,34.04 | 62.99,15.75 64.26,15.75 v64.52,15.49
  Top 0.406: +5V_POWER.2 16.11,28.7 | 17.02,28.7 17.02,28.19 | R22.1 32.51,25.15 C27.- | 13.46,28.7 12.45,29.72 12.45,33.27 13.21,34.04 R23.1 23.43,33.21 25.91,30.73 27.11,30.73 R24.1 | R5.2 R6.2 96.45,9.72 arc-90 UART1A.1 | UART3A.1 arc90 88.33,9.72 R8.2 R7.1 | UART3B.1 arc90 80.71,9.72 R10.1 R9.1
  Top 0.61: C16.1 40.71,4.89 v40.64,4.83 v39.62,4.83 v38.61,4.83 v37.59,4.83
  Top 1.422: 3.3V_POWER.1 31.43,16.14 C21.2 C22.2 31.43,22.89 arc-45 C27.- | C19.1 C20.1 24.7,22.93 C26.- | C35.2 C34.2 19.37,28.77 20.32,29.72 | 16.11,28.7 17.02,28.7 18.03,29.72 20.32,29.72 | 20.32,29.72 C29.- | C28.- 9.91,21.59 | R12.1 R13.1 R14.1 R15.1 R16.1 R17.1 R18.1 R19.1 R20.1 R21.1 28.18,51.58 29.89,51.58 31.67,49.8 C15.2 | C15.2 30.34,48.22 DIO_PG.20 | C23.- 34.72,47.01 33.7,48.03 31.86,48.03 C15.2 | C25.- 95.5,41.15 96.27,41.91 96.27,45.91 C18.2 96.2,48.07 PWM_PG.6 | C24.- 83.31,26.48 C17.2 | C16.1 44.64,4.89 ANA_PG.24
  Top 1.676: 9.91,21.59 9.91,26.92
  Top 1.778: 9.91,26.92 13.46,28.7 +5V_POWER.2
  GND 0.61: C27.- 32.51,24.64
  GND 1.422: C27.- 33.78,26.42 33.78,33.53 34.72,34.47 C23.- 36.98,44.7 SPI2A.1 SPI1.1 38.1,53.85 39.37,55.12 INTERRUTPS_GND.2
  pour GND: 34.54,33.78 33.02,35.31 10.92,35.31 9.4,33.78 9.4,26.42 10.92,24.89 12.19,24.89 14.22,22.86 14.22,17.27 15.24,16.26 24.64,16.26 26.42,14.48 26.42,7.87 27.69,6.6 33.27,6.6 34.54,7.87
  pour GND: 25.15,13.21 23.88,14.48 14.22,14.48 13.21,15.49 13.21,20.32 11.43,22.1 2.54,22.1 1.27,20.83 1.27,8.38 3.05,6.6 23.88,6.6 25.15,7.87
  pour GND: 1.7,53.36 30.4,53.36 31.16,52.6 31.16,40.66 30.15,39.65 1.44,39.65 0.68,40.41 0.68,52.35
  pour GND: 96.52,46.99 97.79,48.26 97.79,53.85 96.52,55.12 89.92,55.12 88.9,54.1 88.9,48.01 89.92,46.99
  pour GND: 100.33,18.03 99.31,19.05 78.23,19.05 77.22,18.03 77.22,2.29 78.23,1.27 99.57,1.27 100.33,2.03
  pour GND: 61.21,51.82 61.21,55.88 60.45,56.64 51.31,56.64 50.55,55.88 50.55,51.82 51.31,51.05 60.45,51.05
  pour GND: 83.82,34.29 83.82,19.81 85.6,18.03 105.41,17.78 107.19,19.56 107.19,34.29 105.41,36.07 85.6,36.07
  pour GND: 74.17,10.16 73.41,10.92 44.45,10.92 43.69,10.16 43.69,1.52 44.2,1.02 73.66,1.02 74.17,1.52
  pour GND: 79.5,56.13 68.58,56.13 66.55,54.1 66.55,50.55 64.26,48.26 51.05,48.26 48.77,45.97 48.77,42.42 46.74,40.39 43.18,40.39 41.91,39.12 41.91,11.68 73.15,11.68 81.53,20.07 81.53,54.1
  pour GND: 89.15,36.32 78.49,36.32 76.96,34.8 76.96,19.56 78.74,17.78 88.65,17.78 90.17,19.3 90.17,35.31
  pour GND: 41.15,7.87 41.15,3.3 40.39,2.54 32.26,2.54 27.69,6.35 27.69,8.13 32.51,8.89 34.54,10.67 37.85,8.64 40.39,8.64
  pour GND: 41.91,26.67 34.04,31.5 34.04,11.69 41.91,11.76
  pour GND: 105.41,36.32 83.57,49.53 83.57,52.07 81.53,54.1 81.53,36.58 83.31,34.8 103.89,34.8
  pour GND: 73.15,11.68 73.15,15.24 73.91,16 77.47,16
  pour GND: 77.22,9.65 77.22,7.87 72.9,11.94 72.9,15.75 73.41,16.26 80.52,16.26 82.3,14.48 82.3,11.18 80.77,9.65
  pour GND: 105.41,17.78 105.41,17.53 100.08,12.19 100.08,11.94 97.28,9.14 94.23,9.14 93.22,10.16 93.22,16 93.98,16.76 98.04,16.76 100.08,18.8 103.38,18.8 103.63,19.05 104.14,19.05
  pour Top: 12.7,34.04 2.29,34.04 1.27,33.02 1.27,22.35 2.54,21.08 7.87,21.08 9.91,19.05 12.45,19.05 14.48,21.08 14.48,33.02 13.46,34.04
INT1  (via drill 0.3)
  Top 0.254: INTERRUTPS_GND.1 52.07,52.32 54.61,49.78 61.21,49.78 61.72,50.29 v61.72,51.31 | v57.4,25.91 55.12,25.91 54.65,25.44 IC1.18
  Bottom 0.254: v61.72,51.31 61.72,50.55 65.28,46.99 65.28,36.32 70.1,31.5 70.1,28.7 68.58,27.18 58.67,27.18 v57.4,25.91
INT2  (via drill 0.3)
  Top 0.254: INTERRUTPS_GND.3 54.61,50.8 54.86,50.55 v60.71,50.55 | v55.21,24.93 IC1.19
  Bottom 0.254: v60.71,50.55 64.52,46.74 64.52,35.81 69.34,30.99 69.34,29.21 68.07,27.94 58.21,27.94 v55.21,24.93
INT3  (via drill 0.3)
  Top 0.254: v68.07,29.46 68.05,29.44 IC1.66
  Bottom 0.254: INTERRUTPS_GND.5 57.15,48.77 57.91,48.01 61.47,48.01 62.48,46.99 62.48,35.56 68.07,29.97 v68.07,29.46
INT4  (via drill 0.3)
  Top 0.254: v68.33,30.73 67.53,29.94 IC1.67
  Bottom 0.254: INTERRUTPS_GND.7 59.69,49.49 60.41,48.77 61.72,48.77 63.25,47.24 63.25,35.81 v68.33,30.73
MCLR
  Top 0.254: R1.2 41.72,10.67 PICKIT.1 37.85,10.67 36.58,11.94 36.58,26.42 38.1,27.94 IC1.13
N$1
  Top 0.254: IC1.85 58.9,40.87 58.93,42.42 C7.1 C8.1
N$2
  Top 0.254: IC1.64 70.6,28.44 74.68,32.51 | 74.68,32.51 Q1.2 75.18,33.78 75.25,33.72 C9.2 | 74.68,32.51 75.37,31.82
N$3
  Top 0.254: IC1.63 70.61,27.94 Q1.1 75.88,22.67 C10.2
N$4
  Top 0.406: RX1A.C 98.55,12.73 R6.1
N$5
  Top 0.406: TX1A.C 98.55,3.78 R5.1
N$6
  Top 0.406: +5V_POWER.4 3.2,34.95 3.56,35.31 24.83,35.31 R23.2
N$7
  Top 0.254: LED3.C 69.7,54.39 R4.1
N$8
  Top 0.254: LED2.C 69.7,48.29 R3.1
N$9
  Top 0.254: LED1.C 69.7,42.2 R2.1
N$10
  Top 0.406: RX3A.C 90.42,12.73 R8.1
N$11
  Top 0.406: TX3B.C 82.55,3.78 R9.2
N$12
  Top 0.406: TX3A.C 90.42,3.78 R7.2
N$14
  Top 0.406: RX3B.C 82.55,12.73 R10.2
N$15
  Top 0.406: 3.3V.C 32.41,32.8 R22.2
N$16
  Top 0.406: +5V_POWER.5 4.83,22.25 4.83,17.78 6.86,15.75 13.46,15.75 15.49,17.78 U$1.2
N$18
  Top 1.422: D1.C 8.55,17.53 C28.+ 13.97,20.07 13.97,23.62 15.47,25.12 +5V_POWER.1
N$19
  Top 0.406: 5V.C 27.28,32.8 R24.2
N$20
  Top 1.422: X2.1 X3.1 5.34,9.17 | 5.34,9.17 X1.1 | 5.34,9.17 3.53,9.17 1.78,10.92 1.78,18.2 D1.A
PGC2
  Top 0.254: IC1.26 51.4,20.83 PICKIT.5
PGD2
  Top 0.254: PICKIT.4 51.31,18.29 51.92,18.9 51.92,20.18 IC1.27
PWM2
  Top 0.254: IC1.76 63.4,39.78 68.33,44.7 70.61,44.7 71.63,45.72 LED2.A 71.63,45.97 73.15,44.45 84.07,44.45 PWM.2
PWM3  (via drill 0.3 pad 0.17)
  Top 0.254: IC1.77 62.9,40.55 64.26,41.91 64.26,45.97 68.33,50.04 69.38,50.04 LED3.A 71.63,52.07 v73.15,50.55
  Bottom 0.254: PWM.3 87.63,50.55 v73.15,50.55
S1
  Top 0.254: S1.- 73.66,43.43 68.58,43.43 64.01,38.86 64.01,34.54 63.5,34.04 60.45,34.04 59.9,34.58 IC1.83
S2
  Top 0.254: S2.- 78.49,49.78 78.49,55.37 77.22,56.64 68.58,56.64 62.48,50.55 62.48,42.42 61.98,41.91 59.94,41.91 59.4,41.37 IC1.84
S3
  Top 0.254: S3.- 73.66,55.88 68.83,55.88 63.25,50.29 63.25,42.42 62.23,41.4 61.72,41.4 61.4,41.08 IC1.80
SCK1  (via drill 0.3)
  Top 0.254: v56.13,38.86 56.13,40.13 53.34,42.93 53.34,48.01 52.83,48.51 49.02,48.51 SPI1.4 | v60.96,31.44 v60.97,31.44 IC1.70
  Bottom 0.254: v56.13,38.86 60.96,34.03 v60.96,31.44
SCK2A
  Top 0.254: IC1.10 41.73,29.44 41.15,30.02 41.15,40.13 SPI2A.4
SDI2A
  Top 0.254: SPI2A.3 43.18,43.94 40.13,40.89 40.13,29.46 40.64,28.96 49.64,28.96 IC1.11
SDO1/PWM1  (via drill 0.3)
  Top 0.254: LED1.A 71.63,35.56 68.51,32.44 IC1.72 v62.29,32.44 | PWM.1 80.77,38.61 73.15,38.61 71.66,40.1 LED1.A | LED1.A 71.92,40.1 | v57.4,39.37 57.4,40.39 54.36,43.43 54.36,48.51 53.34,49.53 50.8,49.53 46.48,53.85 41.91,53.85 40.64,52.58 SPI1.2
  Bottom 0.254: v57.4,39.37 62.29,34.48 v62.29,32.44
SDO2A
  Top 0.254: SPI2A.2 40.64,42.42 39.12,40.89 39.12,28.96 39.62,28.45 IC1.12
U1ARX  (via drill 0.3 pad 0.17)
  Top 0.254: IC1.52 66.21,22.44 v69.34,19.3
  Top 0.406: UART1A.2 arc-90 93.22,10.41 93.22,11.46 arc-90 RX1A.A
  Bottom 0.254: v69.34,19.3 74.42,14.22 79.76,14.22 83.57,10.41 83.57,5.59 86.36,2.79 88.9,2.79 94.23,8.13 UART1A.2
U1ATX  (via drill 0.3 pad 0.17)
  Top 0.254: IC1.53 66.98,22.94 v70.61,19.3
  Top 0.406: UART1A.3 95.5,2.79 TX1A.A
  Bottom 0.254: v70.61,19.3 74.93,14.99 93.98,14.99 97.54,11.43 97.54,7.62 UART1A.3
U3ARX
  Top 0.254: IC1.49 62.9,19.14 63.25,18.8 66.04,18.8 69.34,15.49 81.53,15.49 84.07,12.95 84.07,10.41 85.34,9.14 85.34,9.65
  Top 0.406: UART3A.2 86.87,8.13 arc-90 85.34,9.65 85.34,11.72 arc-90 RX3A.A
U3ATX  (via drill 0.3)
  Top 0.254: IC1.50 65.92,20.19 69.34,16.76 82.04,16.76 v84.84,13.97
  Top 0.406: UART3A.3 87.34,5.55 TX3A.A
  Bottom 0.254: v84.84,13.97 84.84,8.13 UART3A.3
U3BRX  (via drill 0.3 pad 0.17)
  Top 0.254: IC1.40 58.4,18.27 v57.91,17.78 | RX3B.A 78.29,13.72 76.96,12.39 76.96,9.1 77.58,8.49 79.4,8.49 UART3B.2
  Bottom 0.254: v57.91,17.78 57.91,16.76 61.72,12.95 76.39,12.95 76.96,12.39 76.96,9.1 77.68,8.38 UART3B.2
U3BTX  (via drill 0.3 pad 0.17)
  Top 0.254: IC1.39 57.9,19.13 v57.59,18.8
  Top 0.406: UART3B.3 79.47,5.81 TX3B.A
  Bottom 0.254: v57.59,18.8 57.59,18.73 56.9,17.78 56.9,17.02 61.72,12.19 74.97,12.19 75.69,11.47 75.69,6.56 76.41,5.84 UART3B.3

### Text on the board
Top: USB DAQ Board v1.2 | Aerospace @ IITK | PRANJAL
_tsilk: GND | 5V | GND | PWM3 | PWM2 | GND | INT1 | INT2 | INT3 | INT4 | PWM1 | GND | SDO1 | SDI1 | SCK1 | 5V | GND | SDO2A | SDI2A | SCK2A | DIO1 | DIO2 | DIO3 | DIO4 | DIO5 | DIO6 | DIO7 | DIO8 | DIO9 | DIO10 | GND | GND | AN1 | AN2 | AN3 | AN4 | AN8 | AN9 | AN10 | AN11 | AN12 | AN13 | AN14 | AN15 | GND | GND | GND | 3.3V | RX | RX | RX | POWER | POWER | TX | TX | TX | GND